# EAGLE design Power Board (EAGLE 9.2.2)
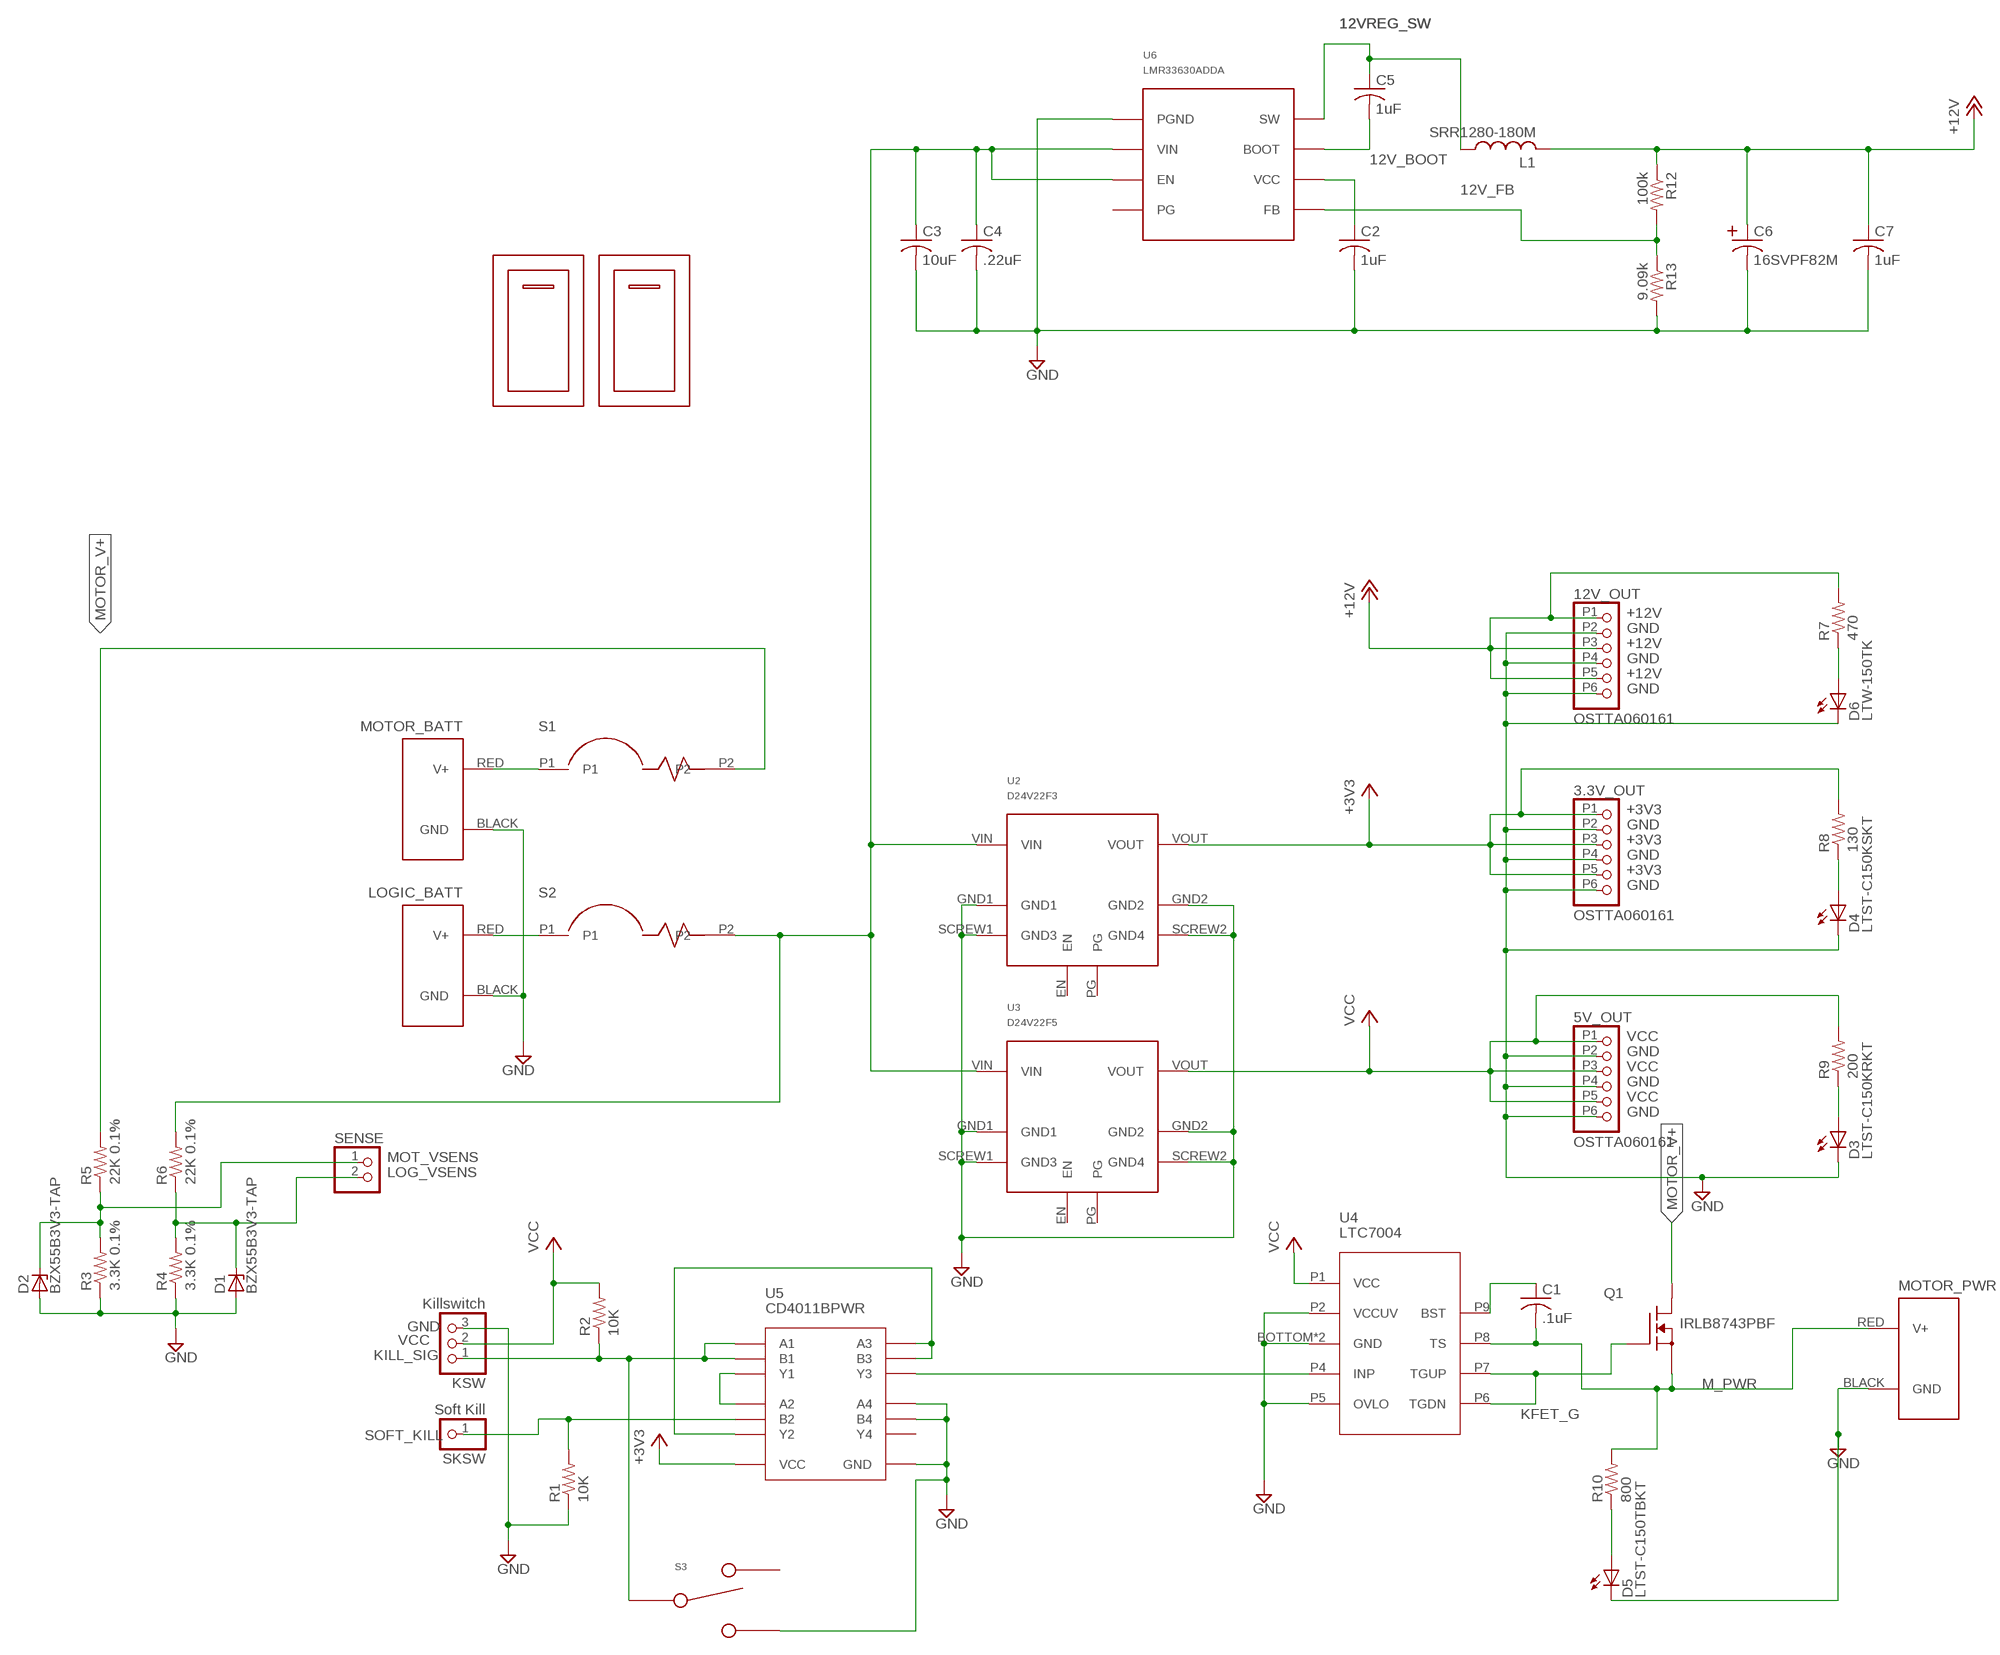
[diagram p0: schematic, sheet 1]

## Parts
3.3V_OUT  OSTTA060161  [OSTTA06]
5V_OUT  OSTTA060161  [OSTTA06]
12V_OUT  OSTTA060161  [OSTTA06]
C1  .1uF  C-USC1206  [C1206]
C2  1uF  C-USC1206  [C1206]
C3  10uF  C-USC1206  [C1206]
C4  .22uF  C-USC1206  [C1206]
C5  1uF  C-USC1206  [C1206]
C6  16SVPF82M  [16SVPF82M]
C7  1uF  C-USC1206  [C1206]
D1  BZX55B3V3-TAP  BZV10  [DO34Z7]
D2  BZX55B3V3-TAP  BZV10  [DO34Z7]
D3  LTST-C150KRKT  [LITEON_LED_1206]
D4  LTST-C150KSKT  [LITEON_LED_1206]
D5  LTST-C150TBKT  [LITEON_LED_1206]
D6  LTW-150TK  [LITEON_LED_1206]
KSW  Killswitch  PINHD-1X3  [1X03]
L1  SRR1280-180M  [SRR1280]
LOGIC_BATT  POWERPOLE_POWER10AWG  [POWERPOLE_PAIR_10AWG]
MOTOR_BATT  POWERPOLE_POWER10AWG  [POWERPOLE_PAIR_10AWG]
MOTOR_PWR  POWERPOLE_POWER10AWG  [POWERPOLE_PAIR_10AWG]
Q1  IRLB8743PBF  [TO220]
R1  10K  R-US_R1206  [R1206]
R2  10K  R-US_R1206  [R1206]
R3  3.3K 0.1%  R-US_R1206  [R1206]
R4  3.3K 0.1%  R-US_R1206  [R1206]
R5  22K 0.1%  R-US_R1206  [R1206]
R6  22K 0.1%  R-US_R1206  [R1206]
R7  470  R-US_R1206  [R1206]
R8  130  R-US_R1206  [R1206]
R9  200  R-US_R1206  [R1206]
R10  800  R-US_R1206  [R1206]
R12  100k  R-US_R1206  [R1206]
R13  9.09k  R-US_R1206  [R1206]
S1  W51-A152A1-20  [W51-A152A1-PINS]
S2  W51-A152A1-20  [W51-A152A1-PINS]
S3  OS102011MS2QN1  [OS102011MS2Q]
SENSE  PINHD-1X2  [1X02]
SKSW  Soft Kill  PINHD-1X1  [1X01]
U2  D24V22F3  [D24V22]
U3  D24V22F5  [D24V22]
U4  LTC7004  [10-MSOP]
U5  CD4011BPWR  [14-TSSOP]
U6  LMR33630ADDA  [HSOIC-8-POWERPAD]
U$1  W51-A152A1-20-CUTOUT  [W51-A152A1-CUTOUT]
U$2  W51-A152A1-20-CUTOUT  [W51-A152A1-CUTOUT]

## Nets
12V_BOOT: C5.2 U6.7(BOOT)
12V_FB: R12.2 R13.1 U6.5(FB)
12VREG_SW: C5.1 L1.1 U6.8(SW)
+3V3: 3.3V_OUT.P1 3.3V_OUT.P3 3.3V_OUT.P5 R8.2 U2.VOUT U5.P14(VCC)
+12V: 12V_OUT.P1 12V_OUT.P3 12V_OUT.P5 C6.POS C7.1 L1.2 R7.2 R12.1
GND: 3.3V_OUT.P2 3.3V_OUT.P4 3.3V_OUT.P6 5V_OUT.P2 5V_OUT.P4 5V_OUT.P6 12V_OUT.P2 12V_OUT.P4 12V_OUT.P6 C2.2 C3.2 C4.2 C6.NEG C7.2 D1.A D2.A D3.C D4.C D5.C D6.C KSW.3 LOGIC_BATT.BLACK(GND) MOTOR_BATT.BLACK(GND) MOTOR_PWR.BLACK(GND) R1.1 R3.1 R4.1 R13.2 S3.L U2.GND1 U2.GND2 U2.SCREW1(GND3) U2.SCREW2(GND4) U3.GND1 U3.GND2 U3.SCREW1(GND3) U3.SCREW2(GND4) U4.BOTTOM(GND) U4.P2(VCCUV) U4.P3(GND) U4.P5(OVLO) U5.P7(GND) U5.P12(A4) U5.P13(B4) U6.1(PGND) U6.THERMAL(PGND)
KFET_G: Q1.G U4.P6(TGDN) U4.P7(TGUP)
KILL_SIG: KSW.1 R2.1 S3.C U5.P1(A1) U5.P2(B1)
LOG_BATT_VIN: LOGIC_BATT.RED(V+) S2.P1
LOG_VIN: C3.1 C4.1 R6.2 S2.P2 U2.VIN U3.VIN U6.2(VIN) U6.3(EN)
LOG_VSENS: D1.C R4.2 R6.1 SENSE.2
M_PWR: C1.2 MOTOR_PWR.RED(V+) Q1.S R10.2 U4.P8(TS)
MOT_BATT_VIN: MOTOR_BATT.RED(V+) S1.P1
MOT_VSENS: D2.C R3.2 R5.1 SENSE.1
MOTOR_V+: Q1.D@1(D) Q1.D@2(D) R5.2 S1.P2
N$1: D6.A R7.1
N$2: U5.P3(Y1) U5.P5(A2)
N$3: U5.P4(Y2) U5.P8(A3) U5.P9(B3)
N$4: U4.P4(INP) U5.P10(Y3)
N$5: D4.A R8.1
N$6: D3.A R9.1
N$7: D5.A R10.1
N$8: C2.1 U6.6(VCC)
N$11: C1.1 U4.P9(BST)
SOFT_KILL: R1.2 SKSW.1 U5.P6(B2)
VCC: 5V_OUT.P1 5V_OUT.P3 5V_OUT.P5 KSW.2 R2.2 R9.2 U3.VOUT U4.P1(VCC)
Unconnected: S3.R U2.EN U2.PG U3.EN U3.PG U5.P11(Y4) U6.4(PG)

## Library data of the parts
3.3V_OUT 5V_OUT 12V_OUT = Power Board Custom:OSTTA060161: 6x1 PCB Mount Screw Terminal, 14-20GA
C1-C5 C7 = rcl:C-US: CAPACITOR, American symbol; SPICEPREFIX: C
C6 = Power Board Custom:16SVPF82M: 82uf SMD Polymer Capacitor
D1 D2 = diode:BZV10: Z DIODE
D3 = Power Board Custom:LTST-C150KRKT: Red 631nm LED Indication - Discrete 2V 1206 (3216 Metric)
D4 = Power Board Custom:LTST-C150KSKT: Yellow 591nm LED Indication - Discrete 2.1V 1206 (3216 Metric)
D5 = Power Board Custom:LTST-C150TBKT: Blue 470nm LED Indication - Discrete 3.3V 1206 (3216 Metric)
D6 = Power Board Custom:LTW-150TK: White LED Indication - Discrete 3.2V 1206 (3216 Metric)
KSW = pinhead:PINHD-1X3: PIN HEADER
L1 = Power Board Custom:SRR1280-180M: FIXED IND 18UH 4.8A 35 MOHM SMD
LOGIC_BATT MOTOR_BATT MOTOR_PWR = powerpoles:POWERPOLE_POWER: Anderson Powerpole Power Connector using ameteur radio standard layout
Q1 = Power Board Custom:IRLB8743PBF: High-Current N-Channel MOSFET
R1-R10 R12 R13 = rcl:R-US_: RESISTOR, American symbol; SPICEPREFIX: R
S1 S2 = Power Board Custom:W51-A152A1-20: 20A Circuit Breaker, Mounted in PCB Cutout (wires attach here)
S3 = Power Board Custom:OS102011MS2QN1: SPDT Switch
SENSE = pinhead:PINHD-1X2: PIN HEADER
SKSW = pinhead:PINHD-1X1: PIN HEADER
U2 = Power Board Custom:D24V22F3: Polulu 3.3V 2.5A Voltage Regulator
U3 = Power Board Custom:D24V22F5
U4 = Power Board Custom:LTC7004
U5 = Power Board Custom:CD4011BPWR: IC GATE NAND 4CH 2-INP 14TSSOP
U6 = Power Board Custom:LMR33630ADDA: 3A Voltage Regulator 400 KHz
U$1 U$2 = Power Board Custom:W51-A152A1-20-CUTOUT: Cutout in the PCB for the circuit breaker

## Board
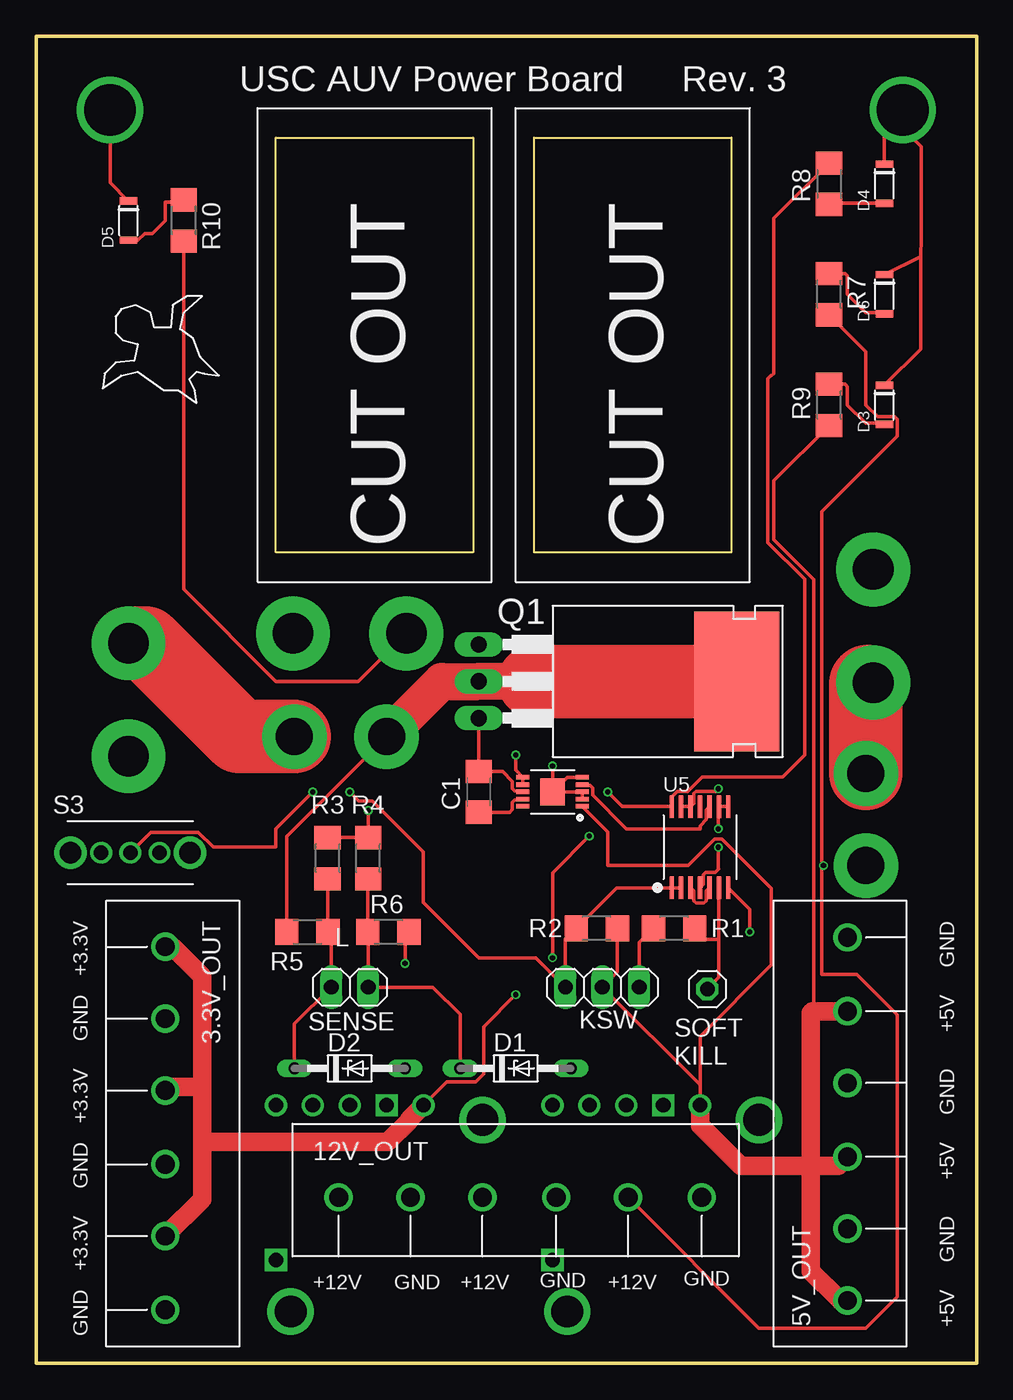
[diagram p1: board, top side]
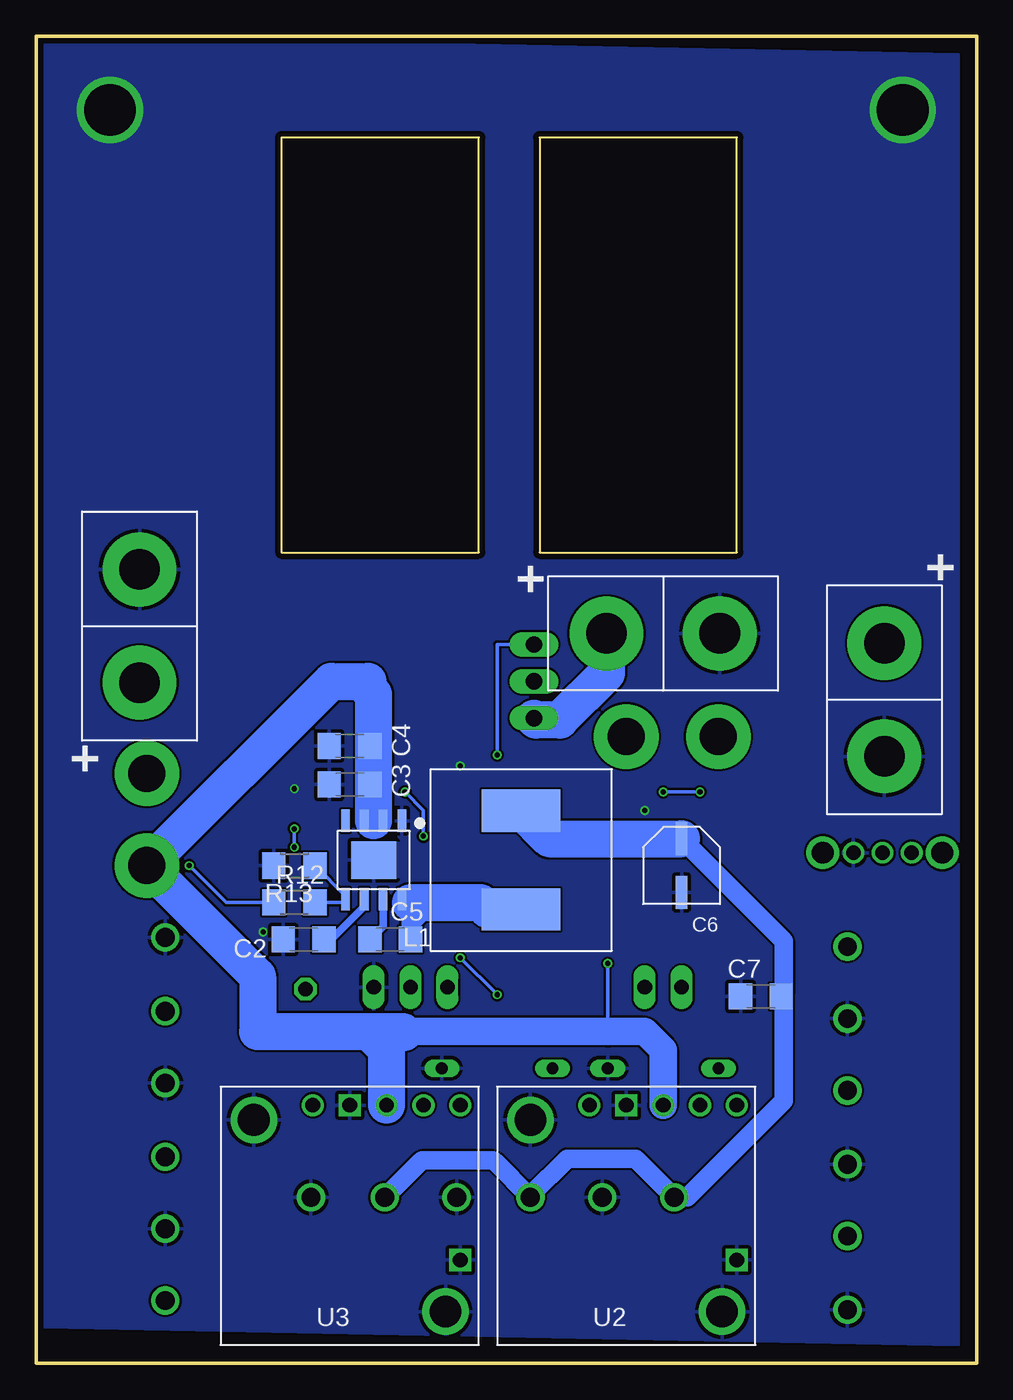
[diagram p2: board, bottom side, seen from below]

Size 64.77 x 91.44 mm. Coordinates in mm from the lower left corner, seen from the top.
Outline: 64.77,91.44 0,91.44 0,0 64.77,0 64.77,91.44
Copper layers (1*16): Top 0.035559375mm / dielectric 1.6mm / Bottom 0.035559375mm
Design rules "oshpark-2layer": minimum track width 6mil, minimum drill 10mil, track to track 6mil, track to pad 6mil, pad to pad 6mil, via to via 6mil, smd to smd 6mil, copper to edge 15mil, drill to drill 6mil, minimum pad ring 5mil, minimum via ring 5mil, stop-mask expansion 2.5mil, vias tented up to drill 0mil, thermal gap 10mil

### Footprints (pad centres in the part's own frame; a part is rotated, then mirrored left to right if it is on the bottom)
OSTTA06 = drill 1.3: P1 -12.192,0; P2 -7.239,0; P3 -2.286,0; P4 2.794,0; P5 7.747,0; P6 12.827,0
C1206 = smd 1.6 x 1.8: 1 -1.4,0; 2 1.4,0
16SVPF82M = smd 0.8 x 2.3: NEG 0,1.85; POS 0,-1.85
DO34Z7 = drill 0.813 long: A 3.81,0; C -3.81,0
LITEON_LED_1206 = smd 0.5 x 1.2: A -1.35,0; C 1.35,0
1X03 = drill 1.016 long: 1 -2.54,0; 2 0,0; 3 2.54,0
SRR1280 = smd 2.896 x 5.41: 1 -3.404,0; 2 3.404,0
POWERPOLE_PAIR_10AWG = drill 2.8 pad 5.08: BLACK 3.9,0; RED -3.9,0
TO220 = drill 1.118 long: D@1 0,-6.35; G -2.54,-6.35; S 2.54,-6.35 | smd 9.652 x 5.842: D@2 0,11.43
R1206 = smd 1.6 x 1.803: 1 -1.422,0; 2 1.422,0
W51-A152A1-PINS = drill 2.54 pad 4.445: P1 -1.27,2.54; P2 -1.27,-3.81
OS102011MS2Q = drill 1.499: BODY@1 -4.115,0; BODY@2 4.115,0 | drill 1: C 0,0; L -2.007,0; R 2.007,0
1X02 = drill 1.016 long: 1 -1.27,0; 2 1.27,0
1X01 = drill 1.016 octagon: 1 0,0
D24V22 = drill 1.016: EN -5.08,-7.62; PG -7.62,-7.62; VIN -2.54,-7.62; VOUT 2.54,-7.62 | drill 1.016 square: GND1 0,-7.62; GND2 -7.62,3.048 | drill 2.184: SCREW1 6.604,-6.604; SCREW2 -6.604,6.604
10-MSOP = smd 1.88 x 1.676: BOTTOM 0,0 | smd 0.305 x 0.889: P1 -1.001,-2.045; P2 -0.5,-2.045; P3 0,-2.045; P4 0.5,-2.045; P5 1.001,-2.045; P6 1.001,2.045; P7 0.5,2.045; P8 0,2.045; P9 -0.5,2.045; P10 -1.001,2.045
14-TSSOP = smd 0.3 x 1.55: P1 -1.95,-2.8; P2 -1.3,-2.8; P3 -0.65,-2.8; P4 0,-2.8; P5 0.65,-2.8; P6 1.3,-2.8; P7 1.95,-2.8; P8 1.95,2.8; P9 1.3,2.8; P10 0.65,2.8; P11 0,2.8; P12 -0.65,2.8; P13 -1.3,2.8; P14 -1.95,2.8
HSOIC-8-POWERPAD = smd 1.55 x 0.6: 1 -2.7,1.95; 2 -2.7,0.65; 3 -2.7,-0.65; 4 -2.7,-1.95; 5 2.7,-1.95; 6 2.7,-0.65; 7 2.7,0.65; 8 2.7,1.95 | smd 2.6 x 3.1: THERMAL 0,0

### Placement (x,y rotation side)
3.3V_OUT  8.89,16.51 270 top
5V_OUT  55.88,16.51 90 top
12V_OUT  33.02,11.43 0 top
C1  30.48,39.37 90 top
C2  46.36,29.21 180 bottom
C3  43.18,39.88 180 bottom
C4  43.18,42.55 180 bottom
C5  40.39,29.21 180 bottom
C6  20.32,34.29 180 bottom
C7  14.86,25.27 180 bottom
D1  33.02,20.32 0 top
D2  21.59,20.32 0 top
D3  58.42,66.04 90 top
D4  58.42,81.28 90 top
D5  6.35,78.74 90 top
D6  58.42,73.66 90 top
KSW  38.99,25.91 0 top
L1  31.37,34.67 90 bottom
LOGIC_BATT  57.66,50.8 90 bottom
MOTOR_BATT  6.35,45.72 270 bottom
MOTOR_PWR  21.59,50.29 0 bottom
Q1  36.83,46.99 270 top
R1  43.94,29.97 0 top
R2  38.61,29.97 0 top
R3  20.07,34.8 270 top
R4  22.86,34.8 270 top
R5  18.67,29.72 180 top
R6  24.26,29.72 0 top
R7  54.61,73.66 270 top
R8  54.61,81.28 90 top
R9  54.61,66.04 270 top
R10  10.16,78.74 270 top
R12  46.99,31.75 0 bottom
R13  46.99,34.29 180 bottom
S1  20.32,44.45 90 top
S2  58.42,38.1 0 top
S3  6.48,35.18 180 top
SENSE  21.59,25.91 0 top
SKSW  46.23,25.78 0 top
U2  24.13,10.16 180 bottom
U3  43.18,10.16 180 bottom
U4  35.56,39.37 90 top
U5  45.72,35.56 0 top
U6  41.53,34.67 270 bottom
U$1  34.29,55.88 0 top
U$2  16.51,55.88 0 top

### Tracks (layer width: path | path; a pad name or v marks a point on that pad's centre or on a via)
12V_BOOT
  Bottom 0.508: U6.7 40.88,30.12 C5.2
12V_FB
  Bottom 0.254: R13.1 43.48,32.2 U6.5 43.7,31.75 R12.2
12VREG_SW
  Bottom 0.254: U6.8 39.36,31.75 38.99,31.75
  Bottom 1.27: C5.1 38.99,30.36 37.59,31.75
  Bottom 2.54: L1.1 33.68,31.27 34.16,31.75 37.59,31.75 38.99,31.75
+3V3  (via drill 0.35)
  Top 0.254: v33.02,25.4 30.81,23.19 30.81,19.93 30.26,19.38 28.27,19.38 U2.VOUT | R8.2 50.8,78.89 50.8,68.2 50.64,68.04 50.6,68.04 50.39,67.83 50.39,56.56 52.93,54.02 52.93,41.91 51.44,40.41 45.88,40.41 44.88,39.41 44.15,39.41 43.77,39.03 U5.P14 40.38,38.36 v39.37,39.37 | v38.1,36.32 35.56,33.78 v35.56,27.94
  Top 1.27: 3.3V_OUT.P5 11.43,11.3 11.43,15.24 | 3.3V_OUT.P1 9.4,28.7 11.43,26.67 11.43,19.05 | 11.43,15.24 11.43,19.05 | 3.3V_OUT.P3 9.14,19.05 11.43,19.05 | U2.VOUT 25.68,16.79 25.68,16.69 24.23,15.24 11.43,15.24
  Bottom 0.254: v39.37,39.37 38.1,38.1 v38.1,36.32 | v35.56,27.94 v33.02,25.4
+12V  (via drill 0.35)
  Top 0.254: R7.2 57.15,69.7 57.15,66.04 57.97,65.22 59.14,65.22 59.3,65.06 59.3,63.89 54.1,58.69 54.1,34.29 | 12V_OUT.P5 49.78,2.41 57.15,2.41 59.31,4.57 59.31,24 56.52,26.8 54.1,26.8 54.1,34.29 | v54.23,34.29 54.1,34.29
  Bottom 0.254: v54.23,34.29 51.69,31.75 R12.1 | 13.28,25.45 C7.1
  Bottom 1.27: 12V_OUT.P5 38.3,13.9 arc45 38.12,13.97 33.38,13.97 arc45 33.2,13.9 12V_OUT.P3 30.73,11.45 arc45 30.66,11.63 28.19,14.1 23.6,14.1 arc45 23.42,14.02 12V_OUT.P1 19.94,11.43 13.28,18.09 13.28,25.1 C7.1 | C6.POS 13.28,29.1 13.28,25.45
  Bottom 2.54: L1.2 29.43,36.14 C6.POS
GND  (via drill 0.35, 3.56)
  Top 0.254: D4.C 58.42,85.09 v59.69,86.36 59.69,85.09 60.96,83.82 60.96,77.55 60.93,76.26 | D6.C 60.93,76.26 | D3.C 60.93,69.9 60.93,76.26 | D5.C 5.08,81.36 v5.08,86.36 | R3.1 R4.1 v22.86,38.1 | U5.P13 U5.P12 45.29,38.58 45.29,39.25 45.45,39.41 46.81,39.41 v46.99,39.59 | R1.1 41.53,28.98 KSW.3 | U4.P2 U4.P3 U4.BOTTOM | U4.P5 36.56,40.37 U4.BOTTOM | U4.BOTTOM v35.56,41.15 | U5.P7 49.15,31.28 v49.15,29.72
  pour Bottom: 1.27,90.17 66.04,91.44 66.04,2.54 1.27,1.27
  pour Bottom (no thermals): 40.64,35.81 39.37,35.81 39.37,33.53 40.64,33.53
KFET_G  (via drill 0.35)
  Top 0.254: v33.02,41.91 33.02,40.87 U4.P6 U4.P7
  Bottom 0.254: Q1.G 33.02,49.53 v33.02,41.91
KILL_SIG  (via drill 0.35)
  Top 0.254: S3.C 7.88,36.58 11.17,36.58 12.2,35.56 16.51,35.56 16.51,36.83 v19.05,39.37 | v21.59,39.37 22.2,38.76 23.13,38.76 26.67,35.22 26.67,31.75 30.48,27.94 34.42,27.94 KSW.1 36.45,29.23 R2.1 39.8,32.59 39.97,32.76 U5.P1 U5.P2
  Bottom 0.254: v19.05,39.37 v21.59,39.37
LOG_BATT_VIN
  Top 5.08: S2.P1 57.15,46.8 arc-45 57.22,46.97 LOGIC_BATT.RED
LOG_VIN  (via drill 0.35)
  Top 0.254: v25.4,27.56 25.4,29.44 R6.2
  Bottom 0.254: 25.4,22.86 v25.4,27.56 | U6.3 42.16,37.39 41.53,37.39 | U6.2 40.9,37.39 41.53,37.39 | 41.53,37.39 41.78,37.64 C3.1 | C4.1 41.78,40.89 41.53,40.64
  Bottom 1.905: U2.VIN 21.59,21.59 22.79,22.79 arc-45 22.97,22.86 25.4,22.86 39.27,22.86 arc-45 39.44,22.79
  Bottom 2.54: 41.53,37.39 41.53,40.64 41.53,46.1 41.91,46.48 41.91,46.99 44.45,46.99 S2.P2 49.53,26.67 49.53,22.86 41.91,22.86 | 41.91,22.86 39.52,22.86 39.44,22.79 | U3.VIN 40.64,21.59 41.91,22.86
LOG_VSENS
  Top 0.254: D1.C 29.21,24.02 27.33,25.91 SENSE.2 22.86,29.69 R6.1 22.84,33.35 R4.2
M_PWR
  Top 0.254: R10.2 10.16,53.34 16.51,46.99 22.19,46.99 MOTOR_PWR.RED | Q1.S C1.2 32.12,40.77 32.79,40.09 32.79,39.6 32.95,39.44 33.45,39.44 U4.P8
  Bottom 2.54: Q1.S 30.35,44.32 28.7,44.32 25.49,47.53 MOTOR_PWR.RED
MOT_BATT_VIN
  Top 5.08: S1.P1 13.97,43.18 7.53,49.62 MOTOR_BATT.RED
MOT_VSENS
  Top 0.254: D2.C 17.78,23.37 SENSE.1 20.32,29.49 R5.1 20.09,33.35 R3.2
MOTOR_V+
  Top 0.254: R5.2 17.25,36.3 S1.P2
  Top 2.54: 34.29,46.99 Q1.D@1 27.94,46.99 S1.P2
  Top 5.08: Q1.D@2 34.29,46.99
N$1
  Top 0.254: D6.A 58.34,72.39 57.15,72.39 55.88,73.66 55.88,74.93 55.73,75.08 R7.1
N$2
  Top 0.254: U5.P5 46.15,32.54 46.15,31.87 45.99,31.71 45.45,31.71 45.29,31.87 45.29,32.54 U5.P3
N$3  (via drill 0.35)
  Top 0.254: U5.P8 U5.P9 46.99,38.33 v46.99,36.83 | U5.P4 45.94,32.98 45.94,33.65 46.1,33.81 46.77,33.81 47.02,34.06 46.99,34.09 v46.99,35.56
  Bottom 0.254: v46.99,35.56 v46.99,36.83
N$4
  Top 0.254: U4.P4 37.67,39.8 38.17,39.8 38.33,39.64 38.33,39.15 40.65,36.83 45.72,36.83 45.72,37.04 46.15,37.47 46.15,38.14 U5.P10
N$5
  Top 0.254: R8.1 54.68,79.93 D4.A
N$6
  Top 0.254: D3.A 58.34,64.77 57.15,64.77 55.88,66.04 55.88,67.31 55.73,67.46 R9.1
N$7
  Top 0.254: D5.A 7,77.39 7.46,77.85 8,77.85 8.89,78.74 8.89,80.01 10.01,80.01 R10.1
N$8
  Bottom 0.508: C2.1 44.45,29.21 42.18,31.48 U6.6
N$11
  Top 0.254: C1.1 32.62,37.97 32.79,38.15 32.79,38.64 32.95,38.8 33.45,38.8 U4.P9
SOFT_KILL
  Top 0.254: SKSW.1 47.02,26.57 47.02,29.21 | 47.02,29.21 U5.P6 | R1.2 46.13,29.21 47.02,29.21
VCC
  Top 0.254: R2.2 40.03,26.95 KSW.2 45.72,19.18 | U4.P1 39.37,36.6 39.37,34.29 44.9,34.29 46.75,36.14 47.23,36.14 50.64,32.73 50.64,27.45 45.72,22.53 45.72,19.18 | 45.72,19.18 U3.VOUT | R9.2 50.8,60.81 50.8,56.77 53.57,54 53.57,26.76 53.57,26.75 53.57,24.26
  Top 1.27: U3.VOUT 45.72,16.49 arc45 45.79,16.31 48.51,13.59 53.34,13.59 | 53.34,13.59 55.14,13.59 arc45 55.32,13.66 5V_OUT.P3 | 5V_OUT.P1 55.48,4.32 arc-45 55.3,4.39 53.34,6.35 53.34,13.59 | 53.34,13.59 53.34,24.13 53.39,24.18 arc-45 53.57,24.26 5V_OUT.P5

### Text on the board
tPlace: USC AUV Power Board | Rev. 3 | +3.3V | GND | L | GND | +5V | +3.3V | SOFT / KILL | GND | GND | +5V | +3.3V | GND | GND | +12V | GND | +12V | GND | +12V | GND | +5V